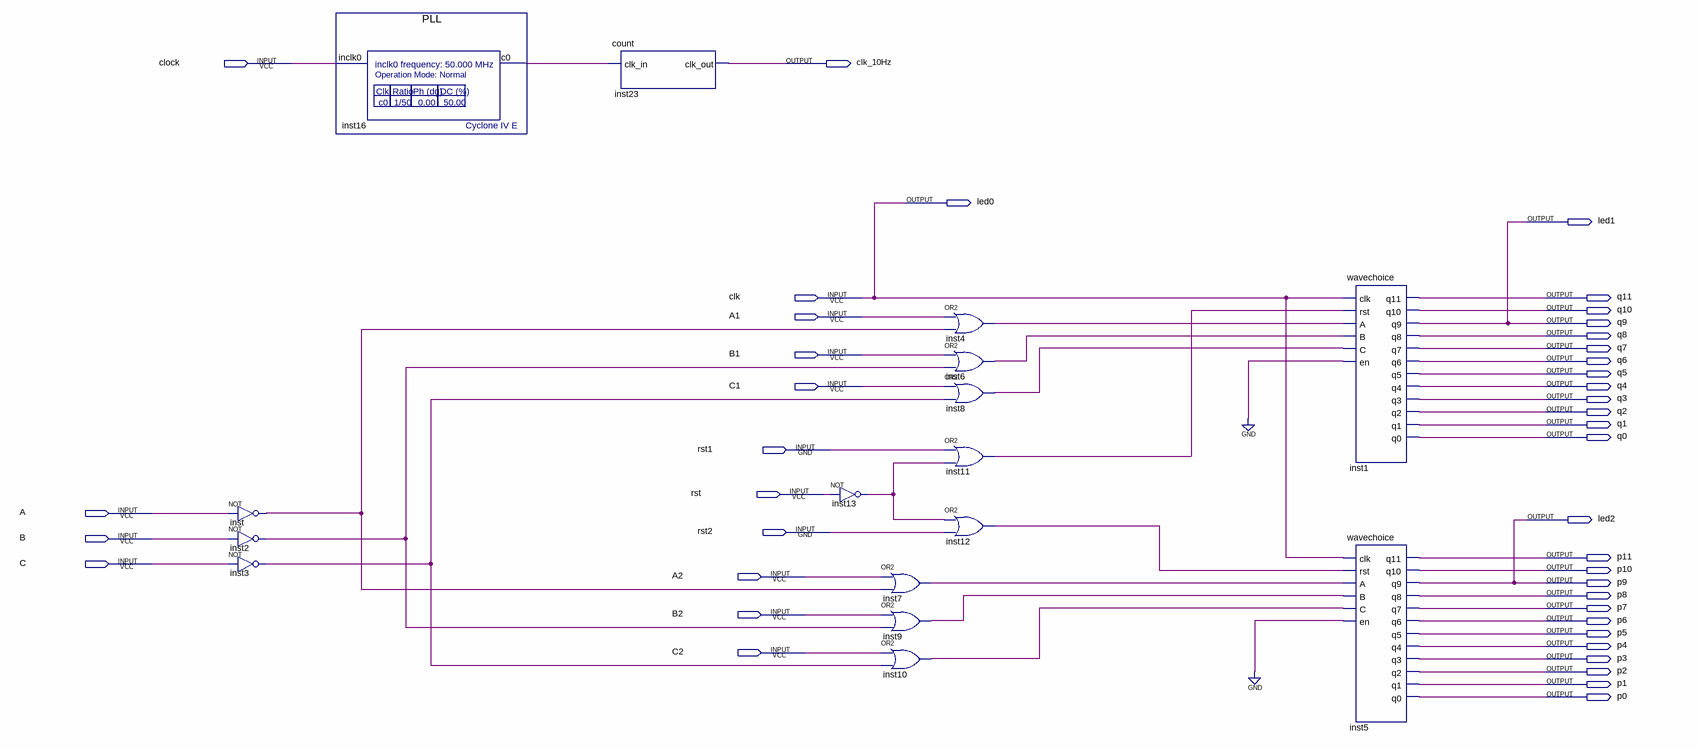
[diagram p0: schematic sheet]
// Quartus schematic DDS.bdf as structural Verilog: 16 symbols, 42 pins
module DDS (
  input  clock,
  input  clk,
  input  A1,
  input  B1,
  input  C1,
  input  rst1,
  input  rst,
  input  A,
  input  rst2,
  input  B,
  input  C,
  input  A2,
  input  B2,
  input  C2,
  output clk_10Hz,
  output led0,
  output led1,
  output q11,
  output q10,
  output q9,
  output q8,
  output q7,
  output q6,
  output q5,
  output q4,
  output q3,
  output q2,
  output q1,
  output q0,
  output led2,
  output p11,
  output p10,
  output p9,
  output p8,
  output p7,
  output p6,
  output p5,
  output p4,
  output p3,
  output p2,
  output p1,
  output p0
);

  wire inst2_out, inst3_out, inst4_out, inst6_out, inst7_out, inst8_out, inst9_out, inst10_out, inst11_out,
       inst12_out, inst13_out, inst16_c0, inst_out;

  not inst (inst_out, A);
  not inst2 (inst2_out, B);
  not inst3 (inst3_out, C);
  PLL inst16 (.inclk0(clock), .c0(inst16_c0));
  count inst23 (.clk_in(inst16_c0), .clk_out(clk_10Hz));
  not inst13 (inst13_out, rst);
  or inst7 (inst7_out, A2, inst_out);
  or inst9 (inst9_out, B2, inst2_out);
  or inst10 (inst10_out, C2, inst3_out);
  or inst4 (inst4_out, A1, inst_out);
  or inst6 (inst6_out, B1, inst2_out);
  or inst8 (inst8_out, C1, inst3_out);
  or inst11 (inst11_out, rst1, inst13_out);
  or inst12 (inst12_out, inst13_out, rst2);
  wavechoice inst1 (
    .clk(clk), .rst(inst11_out), .A(inst4_out), .B(inst6_out), .C(inst8_out), .en(1'b0), .q11(q11),
    .q10(q10), .q9(led1), .q8(q8), .q7(q7), .q6(q6), .q5(q5), .q4(q4), .q3(q3), .q2(q2), .q1(q1), .q0(q0));
  wavechoice inst5 (
    .clk(clk), .rst(inst12_out), .A(inst7_out), .B(inst9_out), .C(inst10_out), .en(1'b0), .q11(p11),
    .q10(p10), .q9(led2), .q8(p8), .q7(p7), .q6(p6), .q5(p5), .q4(p4), .q3(p3), .q2(p2), .q1(p1), .q0(p0));

  assign led0 = clk;
  assign p9 = led2;
  assign q9 = led1;
endmodule
